# Altium schematic sheet extenderTop.SchDoc
size A
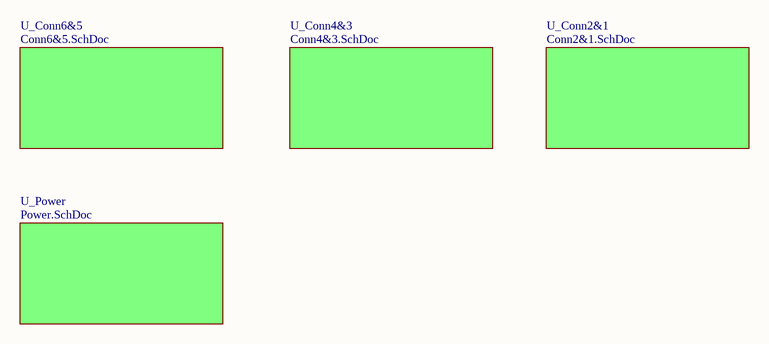
[diagram p0: extenderTop.SchDoc]

## Sub-sheets
U_Conn2&1 = Conn2&1.SchDoc: no entries
U_Conn4&3 = Conn4&3.SchDoc: no entries
U_Conn6&5 = Conn6&5.SchDoc: no entries
U_Power = Power.SchDoc: no entries